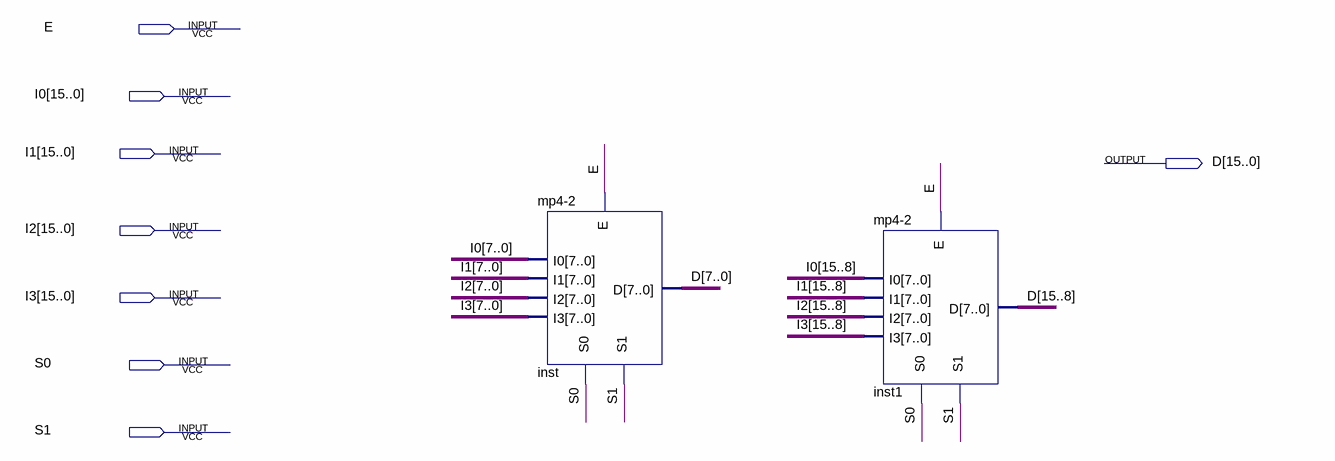
[diagram p0: schematic sheet]
// Quartus schematic mp16_4-2.bdf as structural Verilog: 2 symbols, 8 pins
module \mp16_4-2  (
  input  E,
  input  [15:0] I0,
  input  [15:0] I1,
  input  [15:0] I2,
  input  [15:0] I3,
  input  S0,
  input  S1,
  output [15:0] D
);

  \mp4-2  inst (.E(E), .S0(S0), .S1(S1), .I0(I0[7:0]), .I1(I1[7:0]), .I2(I2[7:0]), .I3(I3[7:0]), .D(D[7:0]));
  \mp4-2  inst1 (.E(E), .S0(S0), .S1(S1), .I0(I0[15:8]), .I1(I1[15:8]), .I2(I2[15:8]), .I3(I3[15:8]), .D(D[15:8]));
endmodule
